# Altium schematic sheet 09_MeasInUI.SchDoc
size A4; Organization: OLTEST; Revision: 01; SheetNumber: 9; SheetTotal: 13; Название листа: Название листа; Разработчик: Бондарчук С.; Прибор: R100; АМАК.000000.000 Э3: R100.230.030.000-00; Дата: 16.04.2019; Формат: A4; Workspacename: R100_Boards_v1
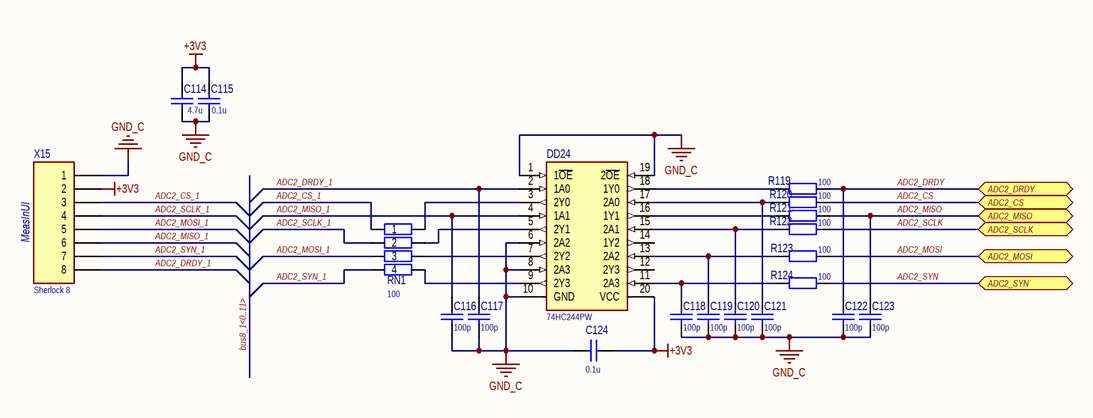
[diagram p0: 09_MeasInUI.SchDoc]

## Parts
C114  4.7u  [SMD_C_0805]
C115  0.1u  [SMD_C_0603]
C116  100p  [SMD_C_0603]
C117  100p  [SMD_C_0603]
C118  100p  [SMD_C_0603]
C119  100p  [SMD_C_0603]
C120  100p  [SMD_C_0603]
C121  100p  [SMD_C_0603]
C122  100p  [SMD_C_0603]
C123  100p  [SMD_C_0603]
C124  0.1u  [SMD_C_0603]
DD24  74HC244PW  [TSSOP20]
R119  100  [SMD_R_0603]
R120  100  [SMD_R_0603]
R121  100  [SMD_R_0603]
R122  100  [SMD_R_0603]
R123  100  [SMD_R_0603]
R124  100  [SMD_R_0603]
RN1  100  [CRA06S]
X15  Sherlock 8  [35362-0850]

## Ports
ADC2_CS, ADC2_DRDY, ADC2_MISO, ADC2_MOSI, ADC2_SCLK, ADC2_SYN

## Nets
+3V3: C114.2 C115.2 C124.2 DD24.20(VCC) X15.2
GND_C: C114.1 C115.1 C116.2 C117.2 C118.2 C119.2 C120.2 C121.2 C122.2 C123.2 C124.1 DD24.1(1~{OE}) DD24.6(2A2) DD24.8(2A3) DD24.10(GND) DD24.19(2~{OE}) X15.1
ADC2_CS: R120.2 ; port ADC2_CS
ADC2_CS_1: RN1.1 X15.3
ADC2_DRDY: C122.1 R119.2 ; port ADC2_DRDY
ADC2_DRDY_1: C117.1 DD24.2(1A0) X15.8
ADC2_MISO: C123.1 R121.2 ; port ADC2_MISO
ADC2_MISO_1: C116.1 DD24.4(1A1) X15.6
ADC2_MOSI: R123.2 ; port ADC2_MOSI
ADC2_MOSI_1: RN1.3 X15.5
ADC2_SCLK: R122.2 ; port ADC2_SCLK
ADC2_SCLK_1: RN1.2 X15.4
ADC2_SYN: R124.2 ; port ADC2_SYN
ADC2_SYN_1: RN1.4 X15.7
NetC118_1: C118.1 DD24.11(2A3) R124.1
NetC119_1: C119.1 DD24.13(2A2) R123.1
NetC120_1: C120.1 DD24.15(2A1) R122.1
NetC121_1: C121.1 DD24.17(2A0) R120.1
NetDD24_3: DD24.3(2Y0) RN1.8
NetDD24_5: DD24.5(2Y1) RN1.7
NetDD24_7: DD24.7(2Y2) RN1.6
NetDD24_9: DD24.9(2Y3) RN1.5
NetDD24_16: DD24.16(1Y1) R121.1
NetDD24_18: DD24.18(1Y0) R119.1

Not connected (* = marked no-connect by the designer): DD24 12(2Y3) 14(1Y2)

## Buses and harness runs
bus bus8_1<0..11>

## Notes on the sheet
- (near X15) MeasInUI
- Разработчик:
- Формат:
- Rev.:
- Лист
- Дата:
- Листов
- WorkSpace:
- Дата изм.:

## Library data of the parts
C114 = C0805 4.7u 25V 20%  X5R: SMD C 0805 MURATA 50V 5% NP0; PartNumber: GRM21BR61E475M; Manufacturer: MURATA; Value: 4.7u
C115 C124 = C0603 0.1u 50V 10%: SMD C 0603 MURATA 50V 10% X7R; PartNumber: GRM188R71H104K; Manufacturer: MURATA; Value: 0.1u
C116-C123 = C0603 100p 100V 5%: SMD C 0603 MURATA 100V 5% NP0; PartNumber: GRM1885C2A101JA01; Manufacturer: MURATA; Value: 100p
DD24 = 74HC244PW: Octal Buffer/Line Driver with 3-State Outputs, PW0020A; Manufacturer: NXP; PartNumber: 74HC244PW
R119-R124 = R0603 100 1%: SMD R 0603 VISHAY 0.1W 75V 1% 100ppm; PartNumber: CRCW0603100RFK; Manufacturer: VISHAY; Value: 100
RN1 = CRA06S 4x100 1%: SMD RESISTOR ARRAY VISHAY 0.063W 50V 1% 100ppm; PartNumber: CRA06S083100RF; Manufacturer: VISHAY; Value: 100
X15 = 35362-0850: Sherlock 8 Side, 2A 125V 2mm; Manufacturer: MOLEX; PartNumber: 35362-0850